# EAGLE design TP4056_18650 (EAGLE 6.3)
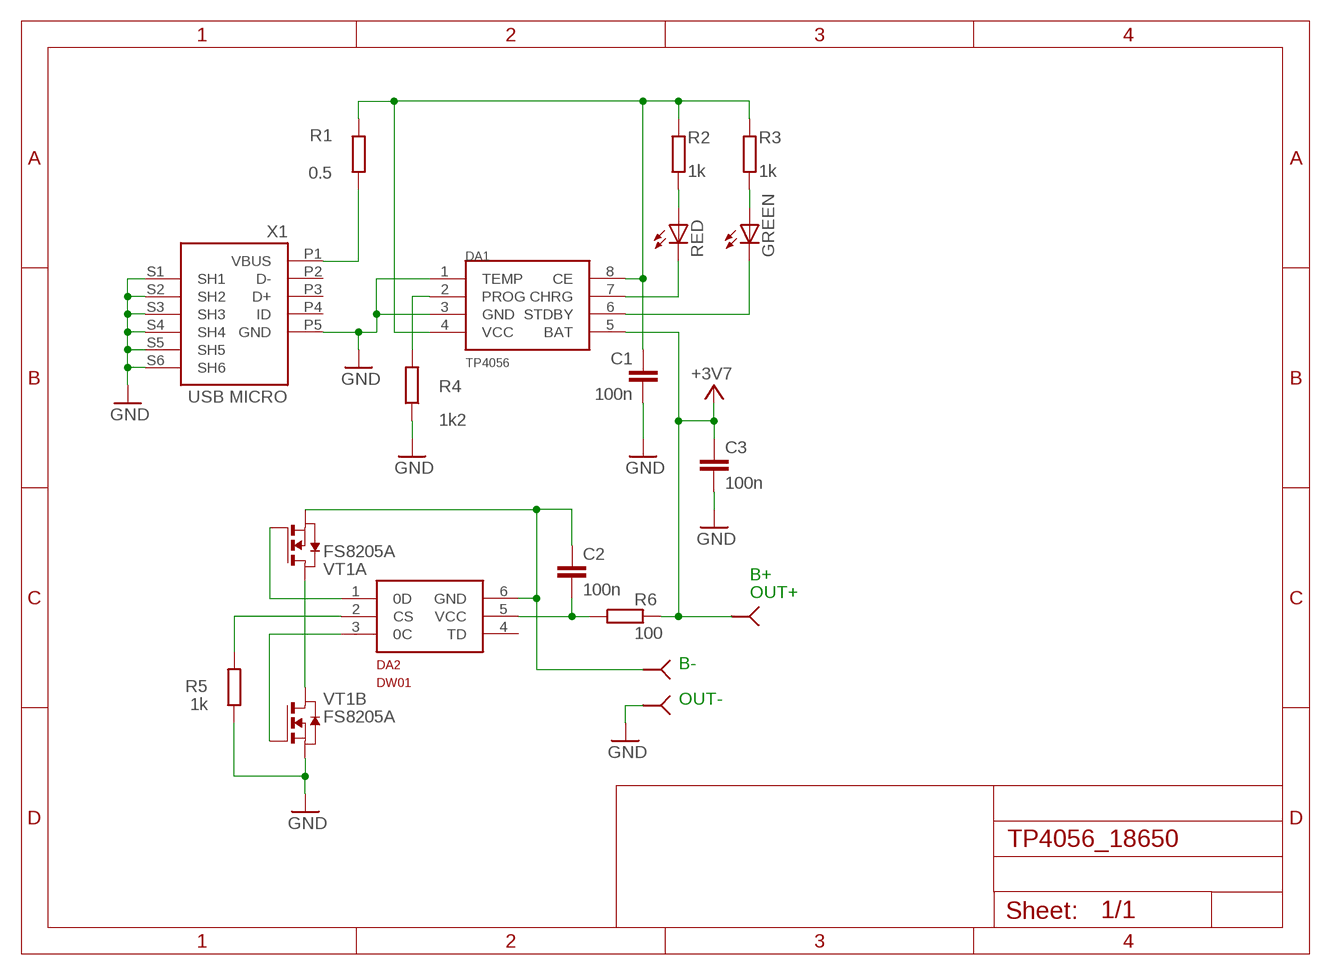
[diagram p0: schematic, sheet 1]

## Parts
B+  B-  [PAD-]
B-  B-  [PAD-]
C1  100n  C-EUC0805  [C0805]
C2  100n  C-EUC0805  [C0805]
C3  100n  C-EUC0805  [C0805]
DA1  TP4056  [SOP-8]
DA2  DW01A  DW01  [SOT23-6]
GND  B-  [PAD-]
GREEN  LEDCHIP-LED0805  [CHIP-LED0805]
R1  0.5  R-EU_R0805  [R0805]
R2  1k  R-EU_R0805  [R0805]
R3  1k  R-EU_R0805  [R0805]
R4  1k2  R-EU_R0805  [R0805]
R5  1k  R-EU_R0805  [R0805]
R6  100  R-EU_R0805  [R0805]
RED  LEDCHIP-LED0805  [CHIP-LED0805]
VT1  FS8205A  DMN3024LSD  [TSSOP-8]
X1  USB MICRO  MYCON2_USB-MINI-B  [CON2_USB_MICRO_B_AT]

## Nets
+3V7: B+.B- C3.1 DA1.5(BAT) R6.2
B-: B-.B- C2.1 DA2.6(GND) VT1.2(A:S) VT1.3(A:S)
GND: C1.2 C3.2 DA1.1(TEMP) DA1.3(GND) GND.B- R4.1 R5.1 VT1.6(B:S) VT1.7(B:S) X1.P5(GND) X1.S1(SH1) X1.S2(SH2) X1.S3(SH3) X1.S4(SH4) X1.S5(SH5) X1.S6(SH6)
N$1: VT1.1(A:D) VT1.8(B:D)
N$2: DA2.3(0C) VT1.5(B:G)
N$3: C1.1 DA1.4(VCC) DA1.8(CE) R1.2 R2.2 R3.2
N$4: DA2.1(0D) VT1.4(A:G)
N$7: DA2.2(CS) R5.2
N$8: C2.2 DA2.5(VCC) R6.1
N$9: DA1.7(CHRG) RED.C
N$10: DA1.6(STDBY) GREEN.C
N$11: R2.1 RED.A
N$12: GREEN.A R3.1
N$13: DA1.2(PROG) R4.2
N$14: R1.1 X1.P1(VBUS)
Unconnected: DA2.4(TD) X1.P2(D-) X1.P3(D+) X1.P4(ID)

## Notes on the sheet
- B+
- OUT+
- B-
- OUT-

## Library data of the parts
B+ B- GND = TP4056_18650:B-
C1-C3 = rcl:C-EU: CAPACITOR, European symbol
DA1 = TP4056:TP4056
DA2 = DW01:DW01: The DW01-P battery protection IC is designed to protect lithium-ion/polymer battery from damage or degrading the lifetime due to overcharge, overdischarge, and/or overcurrent for one-cell lithium-ion/polymer battery powered systems, such as cellular phones. Data sheet <http://goo.gl/4y108d> Dave.Calaway Eagle Library <https://goo.gl/Muy1Tr>
GREEN RED = led:LED: LED OSRAM: - CHIPLED LG R971, LG N971, LY N971, LG Q971, LY Q971, LO R971, LY R971 LH N974, LH R974 LS Q976, LO Q976, LY Q976 LO Q996 - Hyper CHIPLED LW Q18S LB Q993, LB Q99A, LB R99A - SideLED LS A670, LO A670, LY A670, LG A670, LP A670 LB A673, LV A673, LT A673, LW A673 LH A674 LY A675 LS A676, LA A676, LO A676, LY A676, LW A676 LS A679, LY A679, LG A679 - Hyper Micro SIDELED® LS Y876, LA Y876, LO Y876, LY Y876 LT Y87S - SmartLED LW L88C, LW L88S LB L89C, LB L89S, LG L890 LS L89K, LO L89K, LY L89K LS L896, LA L896, LO L896, LY L896 - TOPLED LS T670, LO T670, LY T670, LG T670, LP T670 LSG T670, LSP T670, LSY T670, LOP T670, LYG T670 LG T671, LOG T671, LSG T671 LB T673, LV T673, LT T673, LW T673 LH T674 LS T676, LA T676, LO T676, LY T676, LB T676, LH T676, LSB T676, LW T676 LB T67C, LV T67C, LT T67C, LS T67K, LO T67K, LY T67K, LW E67C LS E67B, LA E67B, LO E67B, LY E67B, LB E67C, LV E67C, LT E67C LW T67C LS T679, LY T679, LG T679 LS T770, LO T770, LY T770, LG T770, LP T770 LB T773, LV T773, LT T773, LW T773 LH T774 LS E675, LA E675, LY E675, LS T675 LS T776, LA T776, LO T776, LY T776, LB T776 LHGB T686 LT T68C, LB T68C - Hyper Mini TOPLED® LB M676 - Mini TOPLED Santana® LG M470 LS M47K, LO M47K, LY M47K Source: http://www.osram.convergy.de LUXEON: - LUMILED® LXK2-PW12-R00, LXK2-PW12-S00, LXK2-PW14-U00, LXK2-PW14-V00 LXK2-PM12-R00, LXK2-PM12-S00, LXK2-PM14-U00 LXK2-PE12-Q00, LXK2-PE12-R00, LXK2-PE12-S00, LXK2-PE14-T00, LXK2-PE14-U00 LXK2-PB12-K00, LXK2-PB12-L00, LXK2-PB12-M00, LXK2-PB14-N00, LXK2-PB14-P00, LXK2-PB14-Q00 LXK2-PR12-L00, LXK2-PR12-M00, LXK2-PR14-Q00, LXK2-PR14-R00 LXK2-PD12-Q00, LXK2-PD12-R00, LXK2-PD12-S00 LXK2-PH12-R00, LXK2-PH12-S00 LXK2-PL12-P00, LXK2-PL12-Q00, LXK2-PL12-R00 Source: www.luxeon.com KINGBRIGHT: KA-3528ASYC Source: www.kingbright.com
R1-R6 = resistor:R-EU_: RESISTOR, European symbol
VT1 = FS8205A:DMN3024LSD: DUAL N-CHANNEL ENHANCEMENT MODE MOSFET data sheet <http://goo.gl/dRgboR> Dave.Calaway Eagle Library <https://goo.gl/Muy1Tr>
X1 = SmartPrj:MYCON2_USB-MINI-B

## Net classes
0 default: width 0.254 mm, drill 0.61 mm, clearance 0.254 mm
1 power: width 0.254 mm, drill 0.61 mm, clearance 0.254 mm
2 gnd: width 0.254 mm, drill 0.61 mm, clearance 0.254 mm
3 usbvcc: width 0.254 mm, drill 0.61 mm, clearance 0.254 mm
4 aref: width 0.254 mm, drill 0.61 mm, clearance 0.254 mm

## Board
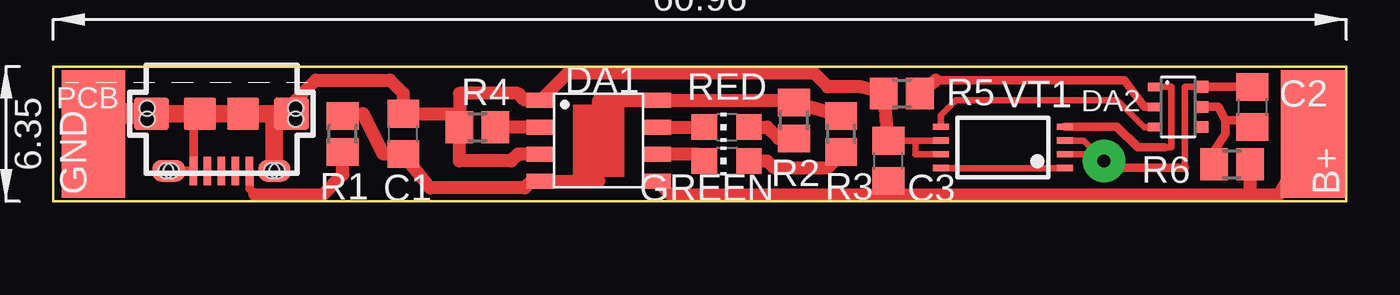
[diagram p1: board, top side]
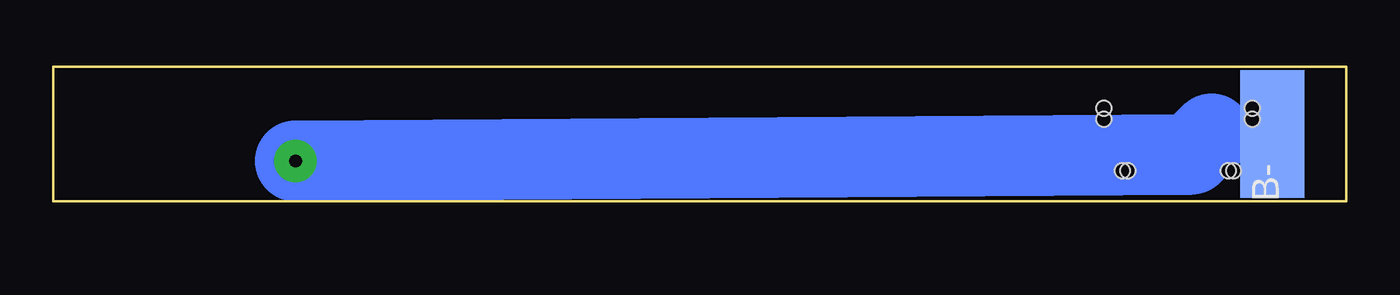
[diagram p2: board, bottom side, seen from below]

Size 60.96 x 6.35 mm. Coordinates in mm from the lower left corner, seen from the top.
Outline: 0,6.35 60.96,6.35 60.96,0 0,0 0,6.35
Copper layers (1*16): Top 0.035mm / dielectric 1.5mm / Bottom 0.035mm
Design rules "default": minimum track width 10mil, minimum drill 24mil, track to track 8mil, track to pad 8mil, pad to pad 8mil, via to via 8mil, smd to smd 8mil, copper to edge 40mil, drill to drill 8mil, minimum pad ring 10mil, minimum via ring 8mil, stop-mask expansion 4mil, vias tented up to drill 0mil, thermal gap 10mil

### Footprints (pad centres in the part's own frame; a part is rotated, then mirrored left to right if it is on the bottom)
PAD- = smd 3 x 6: B- 0,0
C0805 = smd 1.3 x 1.5: 1 -0.95,0; 2 0.95,0
SOP-8 = smd 1.3 x 0.7: 1 -2.75,1.905; 2 -2.75,0.635; 3 -2.75,-0.635; 4 -2.75,-1.905; 5 2.75,-1.905; 6 2.75,-0.635; 7 2.75,0.635; 8 2.75,1.905
SOT23-6 = smd 0.4 x 0.55: 1 -0.95,-1.15; 2 0,-1.15; 3 0.95,-1.15 | smd 0.55 x 0.55: 4 0.95,1.15; 5 0,1.15; 6 -0.95,1.15
CHIP-LED0805 = smd 1.2 x 1.2: A 0,-1.05; C 0,1.05
R0805 = smd 1.3 x 1.5: 1 -0.85,0; 2 0.85,0
TSSOP-8 = smd 0.3 x 0.75: 1 -0.975,-2.925; 2 -0.325,-2.925; 3 0.325,-2.925; 4 0.975,-2.925; 5 0.975,2.925; 6 0.325,2.925; 7 -0.325,2.925; 8 -0.975,2.925
CON2_USB_MICRO_B_AT = smd 0.406 x 1.346: P1 -1.321,2.692; P2 -0.66,2.692; P3 0,2.692; P4 0.66,2.692; P5 1.321,2.692 | smd 1.651 x 1.549: S1 -3.302,0; S2 3.302,0 | smd 1.524 x 1.016: S3 -2.489,2.692; S4 2.489,2.692 | smd 1.524 x 1.524: S5 -1.016,0; S6 1.016,0 | hole 0.7: -3.505,0.254; -3.505,-0.254; 3.505,0.254; 3.505,-0.254; -2.616,2.692; -2.362,2.692; 2.362,2.692; 2.616,2.692

### Placement (x,y rotation side)
B+  59.37,3.17 0 top
B-  3.49,3.17 0 bottom
C1  16.51,3.17 90 top
C2  56.52,4.45 270 top
C3  39.37,1.91 90 top
DA1  25.72,2.86 0 top
DA2  53.02,4.45 270 top
GND  1.91,3.17 0 top
GREEN  31.75,1.91 90 top
R1  13.65,3.17 90 top
R2  34.92,3.81 90 top
R3  37.15,3.17 90 top
R4  20,3.49 0 top
R5  40,5.08 0 top
R6  55.56,1.75 0 top
RED  31.75,3.49 90 top
VT1  44.77,2.54 90 top
X1  7.94,4.13 180 top

### Tracks (layer width: path | path; a pad name or v marks a point on that pad's centre or on a via)
+3V7
  Top 0.61: DA1.5 29.1,0.32 39.37,0.32 | 39.37,0.32 56.52,0.32 | 56.52,0.32 57.78,0.32 B+.B- | R6.2 56.41,0.42 56.52,0.32 | C3.1 39.37,0.32
B-  (via drill 0.6 pad 2)
  Top 0.305: VT1.3 48.59,2.87 v49.53,1.91 48.89,2.21 VT1.2 | 53.34,1.59 53.34,5.4 DA2.6
  Top 0.406: DA2.6 C2.1 | v49.53,1.91 49.53,1.59 53.34,1.59
  Bottom 2.184: 6.35,3.17 B-.B-
  Bottom 3.81: v49.53,1.91 7.3,2.22 6.35,3.17
GND
  Top 0.305: VT1.6 41.28,2.87 40.64,2.86 | 41.28,2.21 VT1.7 40.65,2.21 40.64,2.22 40.64,2.86 | 40.64,2.86 C3.2
  Top 0.406: X1.S6 6.62,4.13 X1.P5 X1.S4
  Top 0.61: R4.1 19.15,1.91 21.59,1.91 21.91,2.22 DA1.3 23.18,2.22 | R4.1 19.15,5.08 21.91,5.08 22.23,4.76 DA1.1 24.24,6.03 35.88,6.03 36.51,5.4 38.1,5.4 R5.1 C3.2 | R4.1 18.83,4.12 C1.2 16.51,5.08 15.87,5.71 12.38,5.71 11.24,4.57 X1.S1
  Top 0.813: X1.S3 10.43,4.13 | X1.S2 X1.S6 X1.S5 10.43,4.13 | 10.43,4.13 X1.S1
  Top 1.016: GND.B- 1.91,4.13 X1.S2
N$1
  Top 0.305: VT1.8 VT1.1
N$2
  Top 0.305: VT1.5 41.84,4.06 42.54,4.76 50.17,4.76 51.43,3.5 DA2.3
N$3
  Top 0.61: R1.2 14.07,4.13 14.6,4.13 15.56,2.22 C1.1 17.78,0.64 22.23,0.64 22.54,0.95 DA1.4 25.72,0.95 25.72,4.76 DA1.8 34.82,4.76 R2.2 R3.2
N$4
  Top 0.305: 52.39,2.54 52.71,2.54 52.71,5.4 DA2.1
  Top 0.406: VT1.4 50.14,3.52 51.12,2.54 52.39,2.54
N$7
  Top 0.406: 41.59,5.71 50.48,5.71 51.43,4.45 DA2.2
  Top 0.61: R5.2 41.59,5.71
N$8
  Top 0.406: 55.24,3.81 54.93,4.45 DA2.5 | 55.24,3.81 56.51,3.81 C2.2 | R6.1 54.71,2.33 55.24,3.17 55.24,3.81
N$9
  Top 0.61: DA1.7 RED.C
N$10
  Top 0.61: GREEN.C 30.38,2.22 DA1.6
N$11
  Top 0.61: RED.A 33.65,3.49 34.19,2.96 R2.1
N$12
  Top 0.61: GREEN.A 33.65,1.91 33.97,1.59 36.51,1.59 37.15,2.22 R3.1
N$13
  Top 0.61: DA1.2 R4.2
N$14
  Top 0.406: X1.P1 9.26,0.58 9.52,0.32
  Top 0.61: 9.52,0.32 12.7,0.32 13.65,1.27 R1.1